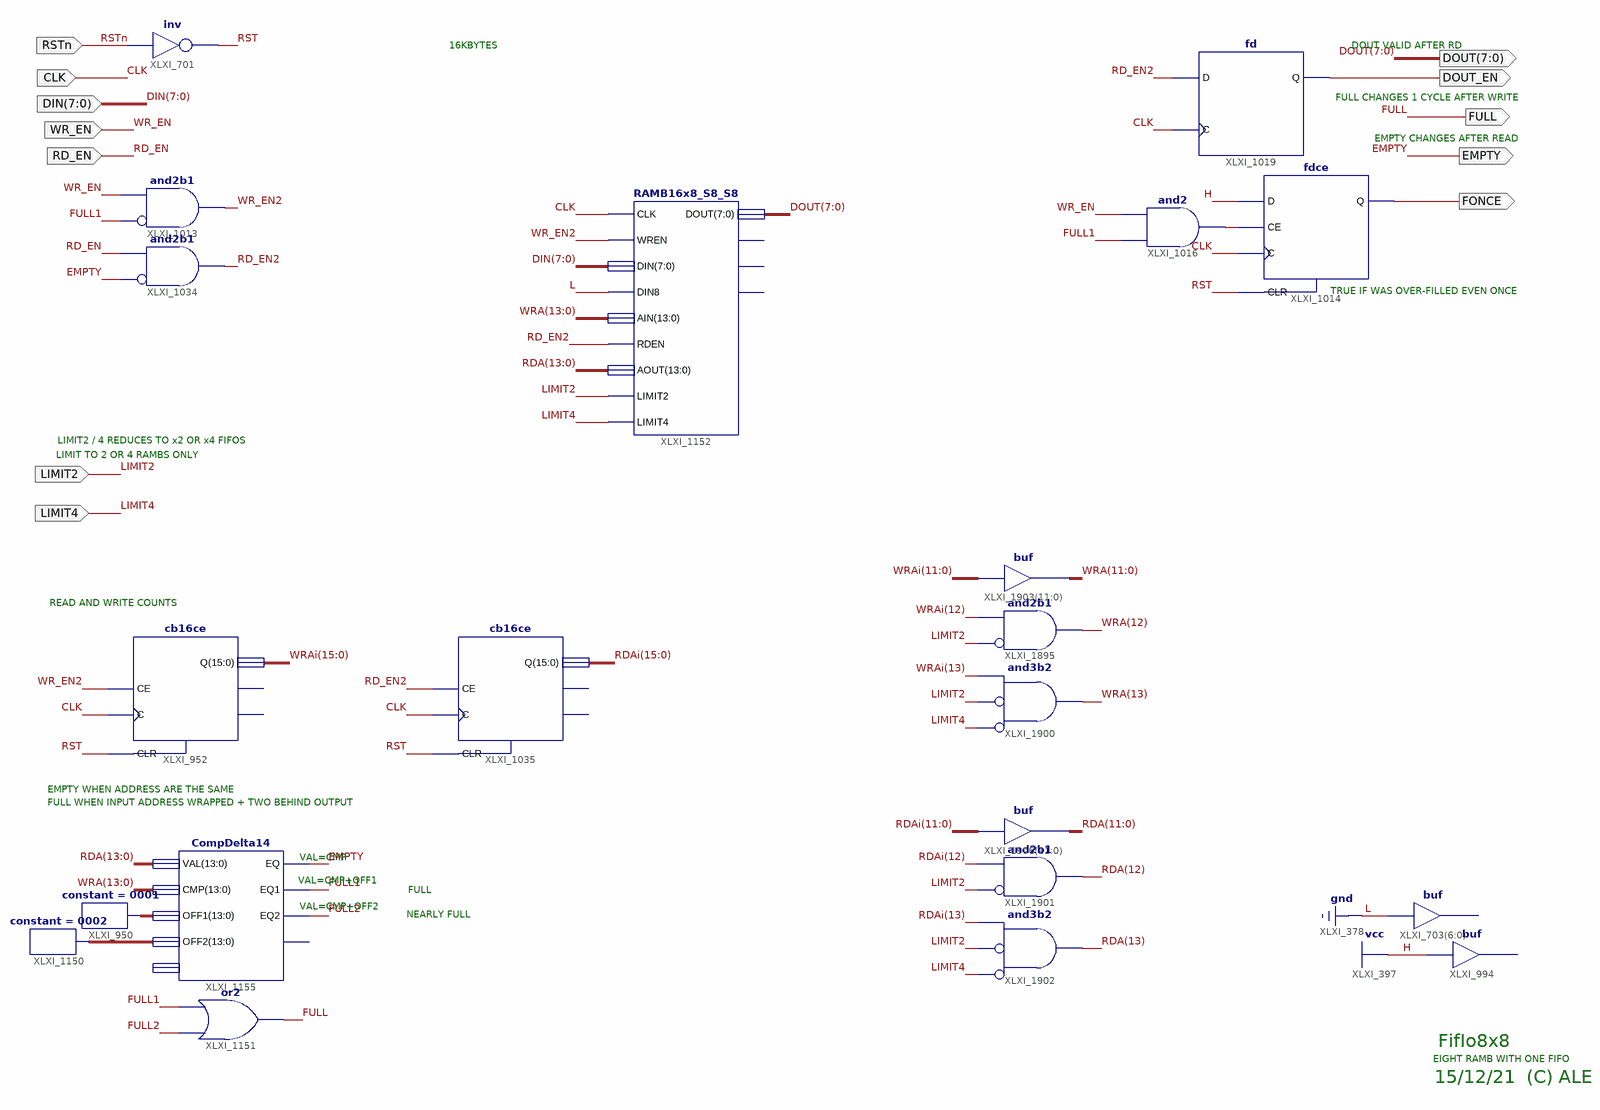
[diagram p0: schematic sheet 1]
// Xilinx ISE schematic FifoIo8x8.sch (spartan3e) as structural Verilog: 21 symbols, 12 ports
module FifoIo8x8 (
  input  CLK,
  input  RSTn,
  input  [7:0] DIN,
  input  WR_EN,
  input  RD_EN,
  input  LIMIT2,
  input  LIMIT4,
  output DOUT_EN,
  output FONCE,
  output EMPTY,
  output FULL,
  output [7:0] DOUT
);

  wire FULL1, FULL2, RD_EN2, RST, WR_EN2, XLXN_708;
  wire [13:0] RDA, WRA, XLXN_1179, XLXN_1180;
  wire [15:0] RDAi, WRAi;

  not XLXI_701 (RST, RSTn);
  and XLXI_1013 (WR_EN2, ~FULL1, WR_EN);  // and2b1
  and XLXI_1034 (RD_EN2, ~EMPTY, RD_EN);  // and2b1
  // buf XLXI_994 has open pins: I=1'b1, O=open
  // buf XLXI_703[6..0] has open pins: I=1'b0, O=open
  fd XLXI_1019 (.C(CLK), .D(RD_EN2), .Q(DOUT_EN));
  and XLXI_1016 (XLXN_708, FULL1, WR_EN);
  fdce XLXI_1014 (.C(CLK), .CE(XLXN_708), .CLR(RST), .D(1'b1), .Q(FONCE));
  cb16ce XLXI_952 (.C(CLK), .CE(WR_EN2), .CLR(RST), .Q(WRAi));  // open: CEO, TC
  constant #(.CValue("0001")) XLXI_950 (.O(XLXN_1179));
  constant #(.CValue("0002")) XLXI_1150 (.O(XLXN_1180));
  or XLXI_1151 (FULL, FULL2, FULL1);
  CompDelta14 XLXI_1155 (
    .CMP(WRA), .EQ(EMPTY), .EQ1(FULL1), .EQ2(FULL2), .OFF1(XLXN_1179), .OFF2(XLXN_1180), .VAL(RDA));  // open: EQ3, OFF3
  RAMB16x8_S8_S8 XLXI_1152 (
    .AIN(WRA), .AOUT(RDA), .CLK(CLK), .DIN(DIN), .DIN8(1'b0), .DOUT(DOUT), .LIMIT2(LIMIT2), .LIMIT4(LIMIT4),
    .RDEN(RD_EN2), .WREN(WR_EN2));  // open: CRASH, CRASH2, DOUT8
  cb16ce XLXI_1035 (.C(CLK), .CE(RD_EN2), .CLR(RST), .Q(RDAi));  // open: CEO, TC
  and XLXI_1895 (WRA[12], ~LIMIT2, WRAi[12]);  // and2b1
  and XLXI_1900 (WRA[13], ~LIMIT4, ~LIMIT2, WRAi[13]);  // and3b2
  assign WRA[11:0] = WRAi[11:0];  // buf XLXI_1903[11..0], 12 bits wide
  and XLXI_1901 (RDA[12], ~LIMIT2, RDAi[12]);  // and2b1
  and XLXI_1902 (RDA[13], ~LIMIT4, ~LIMIT2, RDAi[13]);  // and3b2
  assign RDA[11:0] = RDAi[11:0];  // buf XLXI_1906[11..0], 12 bits wide

  // Notes on the sheet:
  //   16KBYTES
  //   DOUT VALID AFTER RD
  //   FULL CHANGES 1 CYCLE AFTER WRITE
  //   EMPTY CHANGES AFTER READ
  //   TRUE IF WAS OVER-FILLED EVEN ONCE
  //   LIMIT2 / 4 REDUCES TO x2 OR x4 FIFOS
  //   LIMIT TO 2 OR 4 RAMBS ONLY
  //   READ AND WRITE COUNTS
  //   EMPTY WHEN ADDRESS ARE THE SAME
  //   FULL WHEN INPUT ADDRESS WRAPPED + TWO BEHIND OUTPUT
  //   VAL=CMP
  //   VAL=CMP+OFF1
  //   FULL
  //   VAL=CMP+OFF2
  //   NEARLY FULL
  //   FifIo8x8
  //   EIGHT RAMB WITH ONE FIFO
  //   15/12/21  (C) ALE
endmodule
